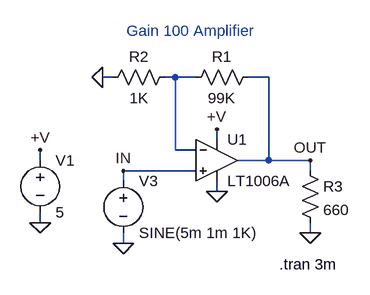
[diagram p0: schematic 1006A.asc]
1006A.asc, the LTspice schematic file:
Version 4
SHEET 1 896 680
WIRE 32 112 16 112
WIRE 128 112 112 112
WIRE 160 112 128 112
WIRE 272 112 240 112
WIRE 192 208 192 192
WIRE 128 224 128 112
WIRE 160 224 128 224
WIRE -80 240 -80 224
WIRE 272 240 272 112
WIRE 272 240 224 240
WIRE 336 240 272 240
WIRE 160 256 48 256
WIRE 336 256 336 240
WIRE 48 272 48 256
WIRE 192 288 192 272
WIRE -80 336 -80 320
WIRE 336 352 336 336
WIRE 48 368 48 352
FLAG -80 336 0
FLAG 192 192 +V
FLAG -80 224 +V
FLAG 16 112 0
FLAG 48 368 0
FLAG 192 288 0
FLAG 336 352 0
FLAG 336 240 OUT
FLAG 48 256 IN
SYMBOL voltage -80 224 R0
SYMATTR InstName V1
SYMATTR Value 5
SYMBOL res 256 96 R90
WINDOW 0 0 56 VBottom 2
WINDOW 3 32 56 VTop 2
SYMATTR InstName R1
SYMATTR Value 99K
SYMBOL res 128 96 R90
WINDOW 0 0 56 VBottom 2
WINDOW 3 32 56 VTop 2
SYMATTR InstName R2
SYMATTR Value 1K
SYMBOL voltage 48 256 R0
SYMATTR InstName V3
SYMATTR Value SINE(5m 1m 1K)
SYMBOL res 320 240 R0
SYMATTR InstName R3
SYMATTR Value 660
SYMBOL opamps\\LT1006A 192 176 R0
SYMATTR InstName U1
TEXT 288 400 Left 2 !.tran 3m
TEXT 152 56 Bottom 2 ;Gain 100 Amplifier

The netlist it stands for:
* 1006A.asc
V1 +V 0 5
R1 OUT N001 99K
R2 N001 0 1K
V3 IN 0 SINE(5m 1m 1K)
R3 OUT 0 660
XU1 IN N001 +V 0 OUT LT1006A  ; pins In+ In- V+ V- OUT
.tran 3m
* Gain 100 Amplifier
.backanno
.end